# Altium schematic sheet AmphenolPowerBreakout.SchDoc
size A
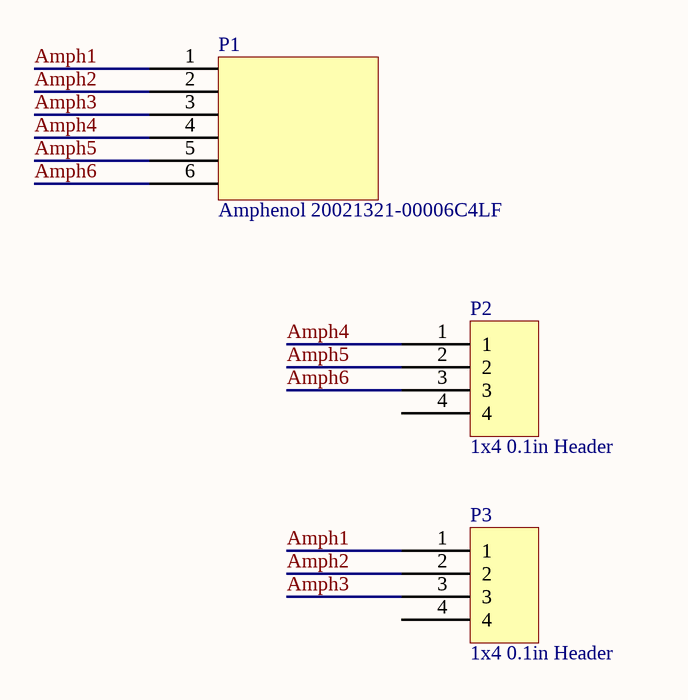
[diagram p0: AmphenolPowerBreakout.SchDoc]

## Parts
P1  Amphenol 20021321-00006C4LF  [Amphenol FCI 20021321-00006C4LF - duplicate]
P2  1x4 0.1in Header  [1x4 0.1in Header]
P3  1x4 0.1in Header  [1x4 0.1in Header]

## Nets
Amph1: P1.1 P3.1
Amph2: P1.2 P3.2
Amph3: P1.3 P3.3
Amph4: P1.4 P2.1
Amph5: P1.5 P2.2
Amph6: P1.6 P2.3

Not connected (* = marked no-connect by the designer): P2 4; P3 4

## Library data of the parts
P1 = Amphenol FCI 20021321-00006C4LF: 6 Position Receptacle Connector 0.050" (1.27mm) Surface Mount Gold; Manufacturer 1: Amphenol FCI; Manufacturer Part Number 1: 20021321-00006C4LF; Supplier 1: Digi-Key; Supplier Part Number 1: 609-3704-1-ND; ComponentLink1URL: *; ComponentLink1URL: https://www.digikey.com/product-detail/en/amphenol-fci/20021321-00006C4LF/609-3704-1-ND/2209148; ComponentLink1Description: Website